# Altium schematic sheet uMultimeter_ExpProbeB_Sch.SchDoc: MicroMultimeter_ExpProbeB
size 127 x 101 mm; Author: Hom; CompanyName: KitSprout; DrawnBy: Hom; Engineer: Hom; Organization: KitSprout; Revision: B; SheetNumber: 1; SheetTotal: 1; License: CC BY-SA 4.0; Version: 2.0; LibVersion: 2.1; PageSetup: Record=PageOptions|CenterHorizontal=True|CenterVertical=True|PrintScale=1.00|XCorrection=1.00|YCorrection=1.00|PrintKind=0|BorderSize=5000000|LeftOffset=0|BottomOffset=0|Orientation=2|PaperLength=1000|PaperWidth=1000|Scale=100|PaperSource=7|PrintQuality=-3|MediaType=1|DitherType=10|PrintScaleMode=0|PaperKind=A4|PaperIndex=9
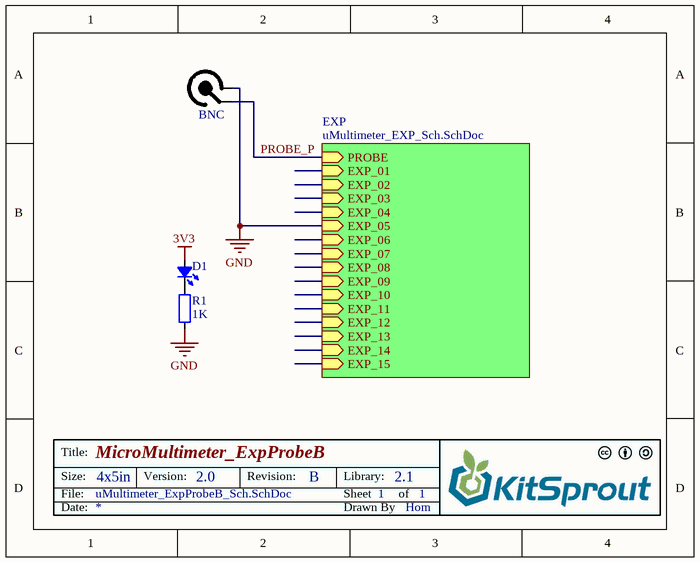
[diagram p0: uMultimeter_ExpProbeB_Sch.SchDoc]

## Parts
BNC  BNC  [BNC_4P]  (value not drawn)
D1  LED_0805  [LED_0805_BLUE]  (value not drawn)
R1  value 1K  [RES_0603]  (hidden comment: Res_0603)

## Sub-sheets
EXP = uMultimeter_EXP_Sch.SchDoc: PROBE (in), EXP_01 (in), EXP_02 (in), EXP_03 (in), EXP_04 (in), EXP_05 (in), EXP_06 (in), EXP_07 (in), EXP_08 (in), EXP_09 (in), EXP_10 (in), EXP_11 (in), EXP_12 (in), EXP_13 (in), EXP_14 (in), EXP_15 (in)

## Nets
3V3: D1.1(A)
GND: BNC.2 R1.2 ; sheet EXP/EXP_05
PROBE_P: BNC.1 ; sheet EXP/PROBE
NetD1_2: D1.2(K) R1.1

## Notes on the sheet
- Title:
- Size:
- Date:
- File:
- 4x5in
- Version:
- Revision:
- Sheet
- Drawn By
- Library:
- of

## Library data of the parts
D1 = LED_0805: LED
R1 = Res_0603: Resistor